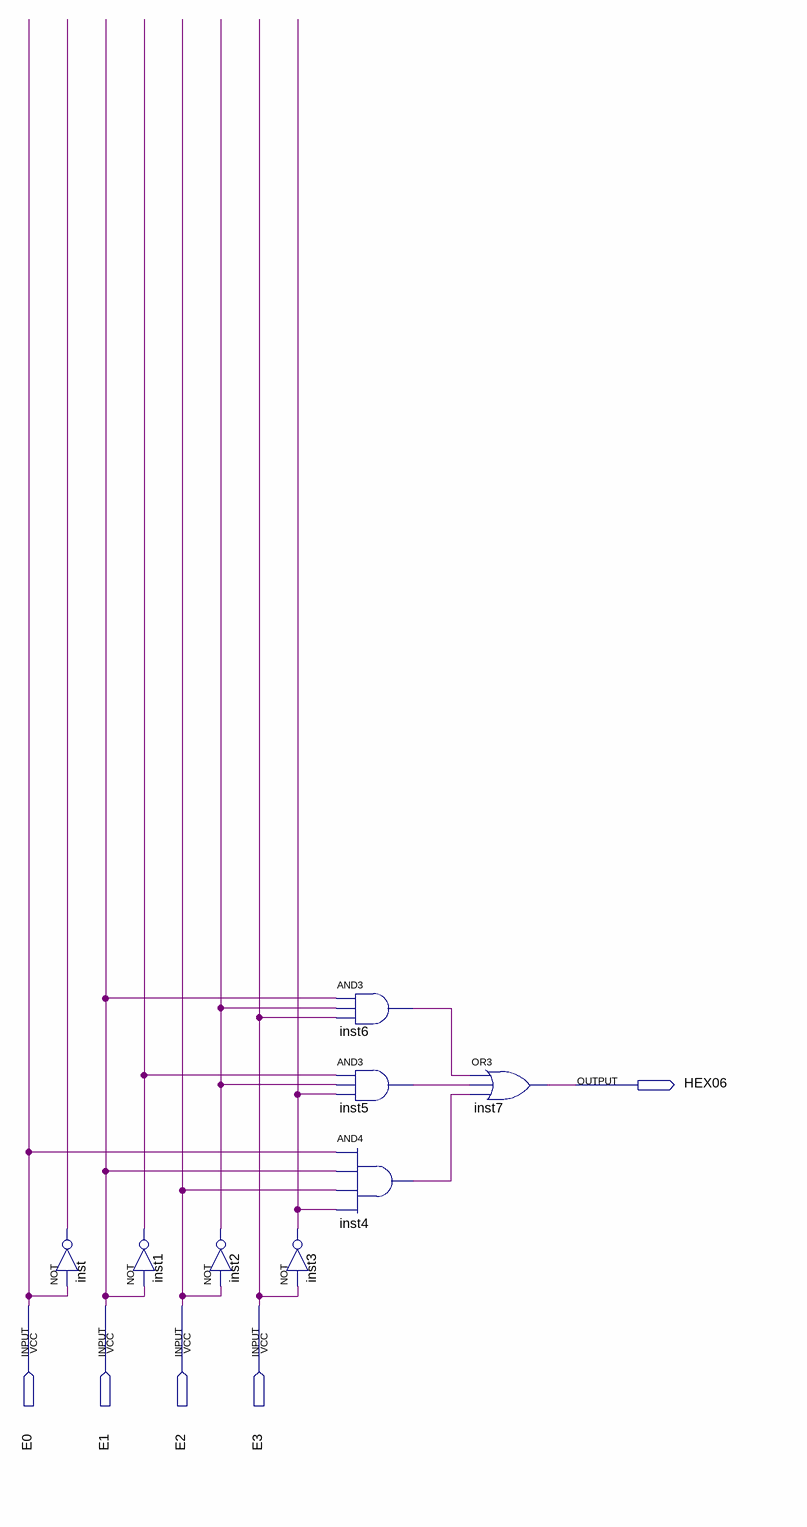
[diagram p0: schematic sheet]
// Quartus schematic HEX_06_4BITS.bdf as structural Verilog: 8 symbols, 5 pins
module HEX_06_4BITS (
  input  E0,
  input  E1,
  input  E2,
  input  E3,
  output HEX06
);

  wire inst1_out, inst2_out, inst3_out, inst4_out, inst5_out, inst6_out, inst_out;

  not inst (inst_out, E0);
  not inst1 (inst1_out, E1);
  not inst2 (inst2_out, E2);
  not inst3 (inst3_out, E3);
  and inst6 (inst6_out, E1, inst2_out, E3);
  and inst5 (inst5_out, inst1_out, inst2_out, inst3_out);
  and inst4 (inst4_out, E0, E1, E2, inst3_out);
  or inst7 (HEX06, inst6_out, inst5_out, inst4_out);
endmodule
